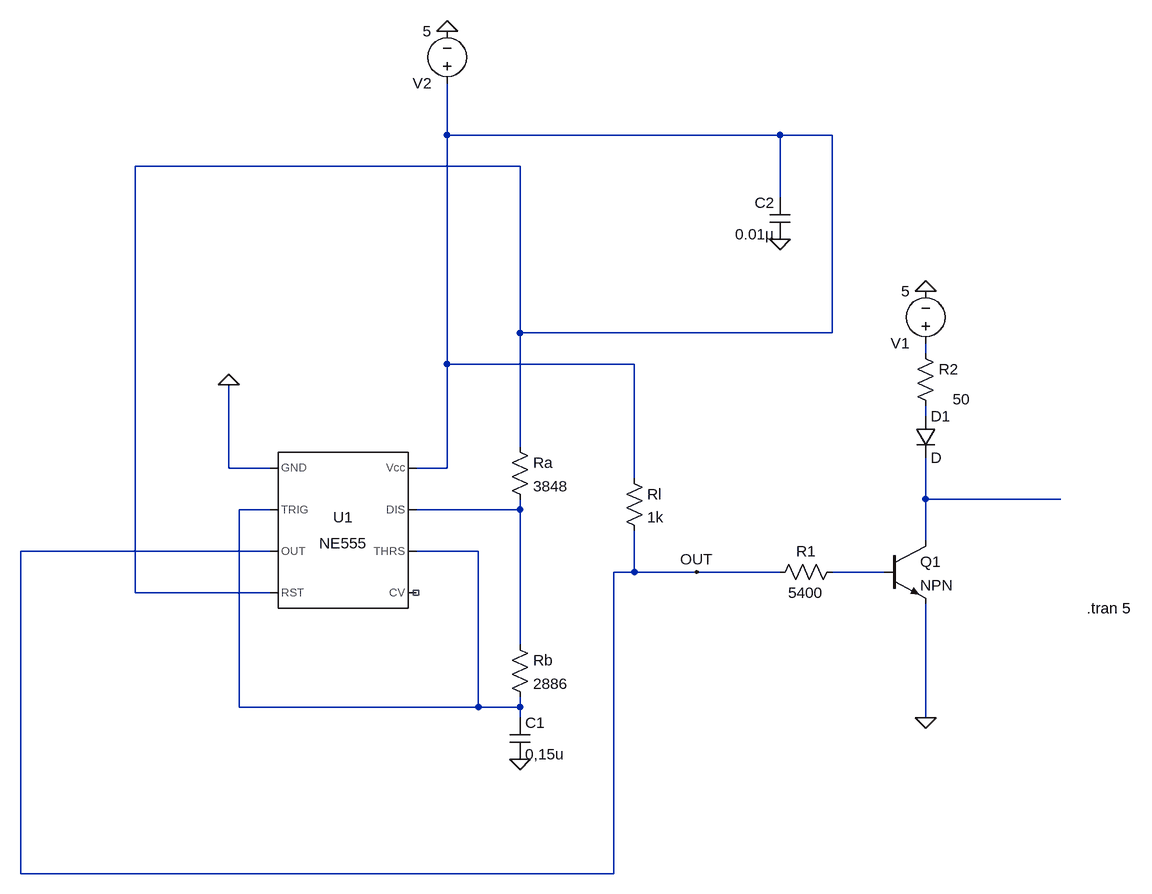
[diagram p0: schematic MLI_actionneur_agitateur.asc]
MLI_actionneur_agitateur.asc, the LTspice schematic file:
Version 4
SHEET 1 1532 728
WIRE 320 -800 320 -880
WIRE 832 -800 320 -800
WIRE 912 -800 832 -800
WIRE 432 -752 -160 -752
WIRE 832 -704 832 -800
WIRE 432 -496 432 -752
WIRE 912 -496 912 -800
WIRE 912 -496 432 -496
WIRE 1056 -464 1056 -480
WIRE 320 -448 320 -800
WIRE 608 -448 320 -448
WIRE 1056 -368 1056 -384
WIRE 432 -320 432 -496
WIRE -16 -288 -16 -416
WIRE 48 -288 -16 -288
WIRE 320 -288 320 -448
WIRE 320 -288 272 -288
WIRE 608 -272 608 -448
WIRE 1056 -240 1056 -304
WIRE 1264 -240 1056 -240
WIRE 48 -224 0 -224
WIRE 432 -224 432 -240
WIRE 432 -224 272 -224
WIRE 1056 -176 1056 -240
WIRE 48 -160 -336 -160
WIRE 368 -160 272 -160
WIRE 608 -128 608 -192
WIRE 608 -128 576 -128
WIRE 704 -128 608 -128
WIRE 832 -128 704 -128
WIRE 992 -128 912 -128
WIRE -160 -96 -160 -752
WIRE 48 -96 -160 -96
WIRE 432 -16 432 -224
WIRE 0 80 0 -224
WIRE 368 80 368 -160
WIRE 368 80 0 80
WIRE 432 80 432 64
WIRE 432 80 368 80
WIRE 432 96 432 80
WIRE 1056 96 1056 -80
WIRE -336 336 -336 -160
WIRE 576 336 576 -128
WIRE 576 336 -336 336
FLAG -16 -416 0
FLAG 832 -640 0
FLAG 432 160 0
FLAG 320 -960 0
FLAG 1056 -560 0
FLAG 1056 96 0
FLAG 704 -128 OUT
SYMBOL Misc\\NE555 160 -192 R0
SYMATTR InstName U1
SYMBOL res 416 -32 R0
SYMATTR InstName Rb
SYMATTR Value 2886
SYMBOL res 416 -336 R0
SYMATTR InstName Ra
SYMATTR Value 3848
SYMBOL cap 416 96 R0
SYMATTR InstName C1
SYMATTR Value 0,15u
SYMBOL cap 848 -640 R180
WINDOW 0 24 56 Left 2
WINDOW 3 24 8 Left 2
SYMATTR InstName C2
SYMATTR Value 0.01µ
SYMBOL res 592 -288 R0
SYMATTR InstName Rl
SYMATTR Value 1k
SYMBOL res 928 -144 R90
WINDOW 0 0 56 VBottom 2
WINDOW 3 32 56 VTop 2
SYMATTR InstName R1
SYMATTR Value 5400
SYMBOL npn 992 -176 R0
SYMATTR InstName Q1
SYMBOL res 1040 -480 R0
WINDOW 3 58 86 Left 2
SYMATTR Value 50
SYMATTR InstName R2
SYMBOL voltage 1056 -464 R180
WINDOW 123 0 0 Left 0
WINDOW 39 0 0 Left 0
SYMATTR InstName V1
SYMATTR Value 5
SYMBOL voltage 320 -864 R180
WINDOW 123 0 0 Left 0
WINDOW 39 0 0 Left 0
SYMATTR InstName V2
SYMATTR Value 5
SYMBOL diode 1040 -368 R0
SYMATTR InstName D1
TEXT 1304 -72 Left 2 !.tran 5

The netlist it stands for:
* MLI_actionneur_agitateur.asc
XU1 0 N005 OUT N001 NC_01 N005 N006 N001 NE555  ; pins GND TRIG OUT RST CV THRS DIS Vcc
Rb N006 N005 2886
Ra N001 N006 3848
C1 N005 0 0,15u
C2 0 N001 0.01µ
Rl N001 OUT 1k
R1 N007 OUT 5400
Q1 N004 N007 0 0 NPN
R2 N002 N003 50
V1 N002 0 5
V2 N001 0 5
D1 N003 N004 D
.model D D
.lib standard.dio
.model NPN NPN
.model PNP PNP
.lib standard.bjt
.tran 5
.lib NE555.sub
.backanno
.end